# EAGLE design OSSILEDController (EAGLE 6.1)
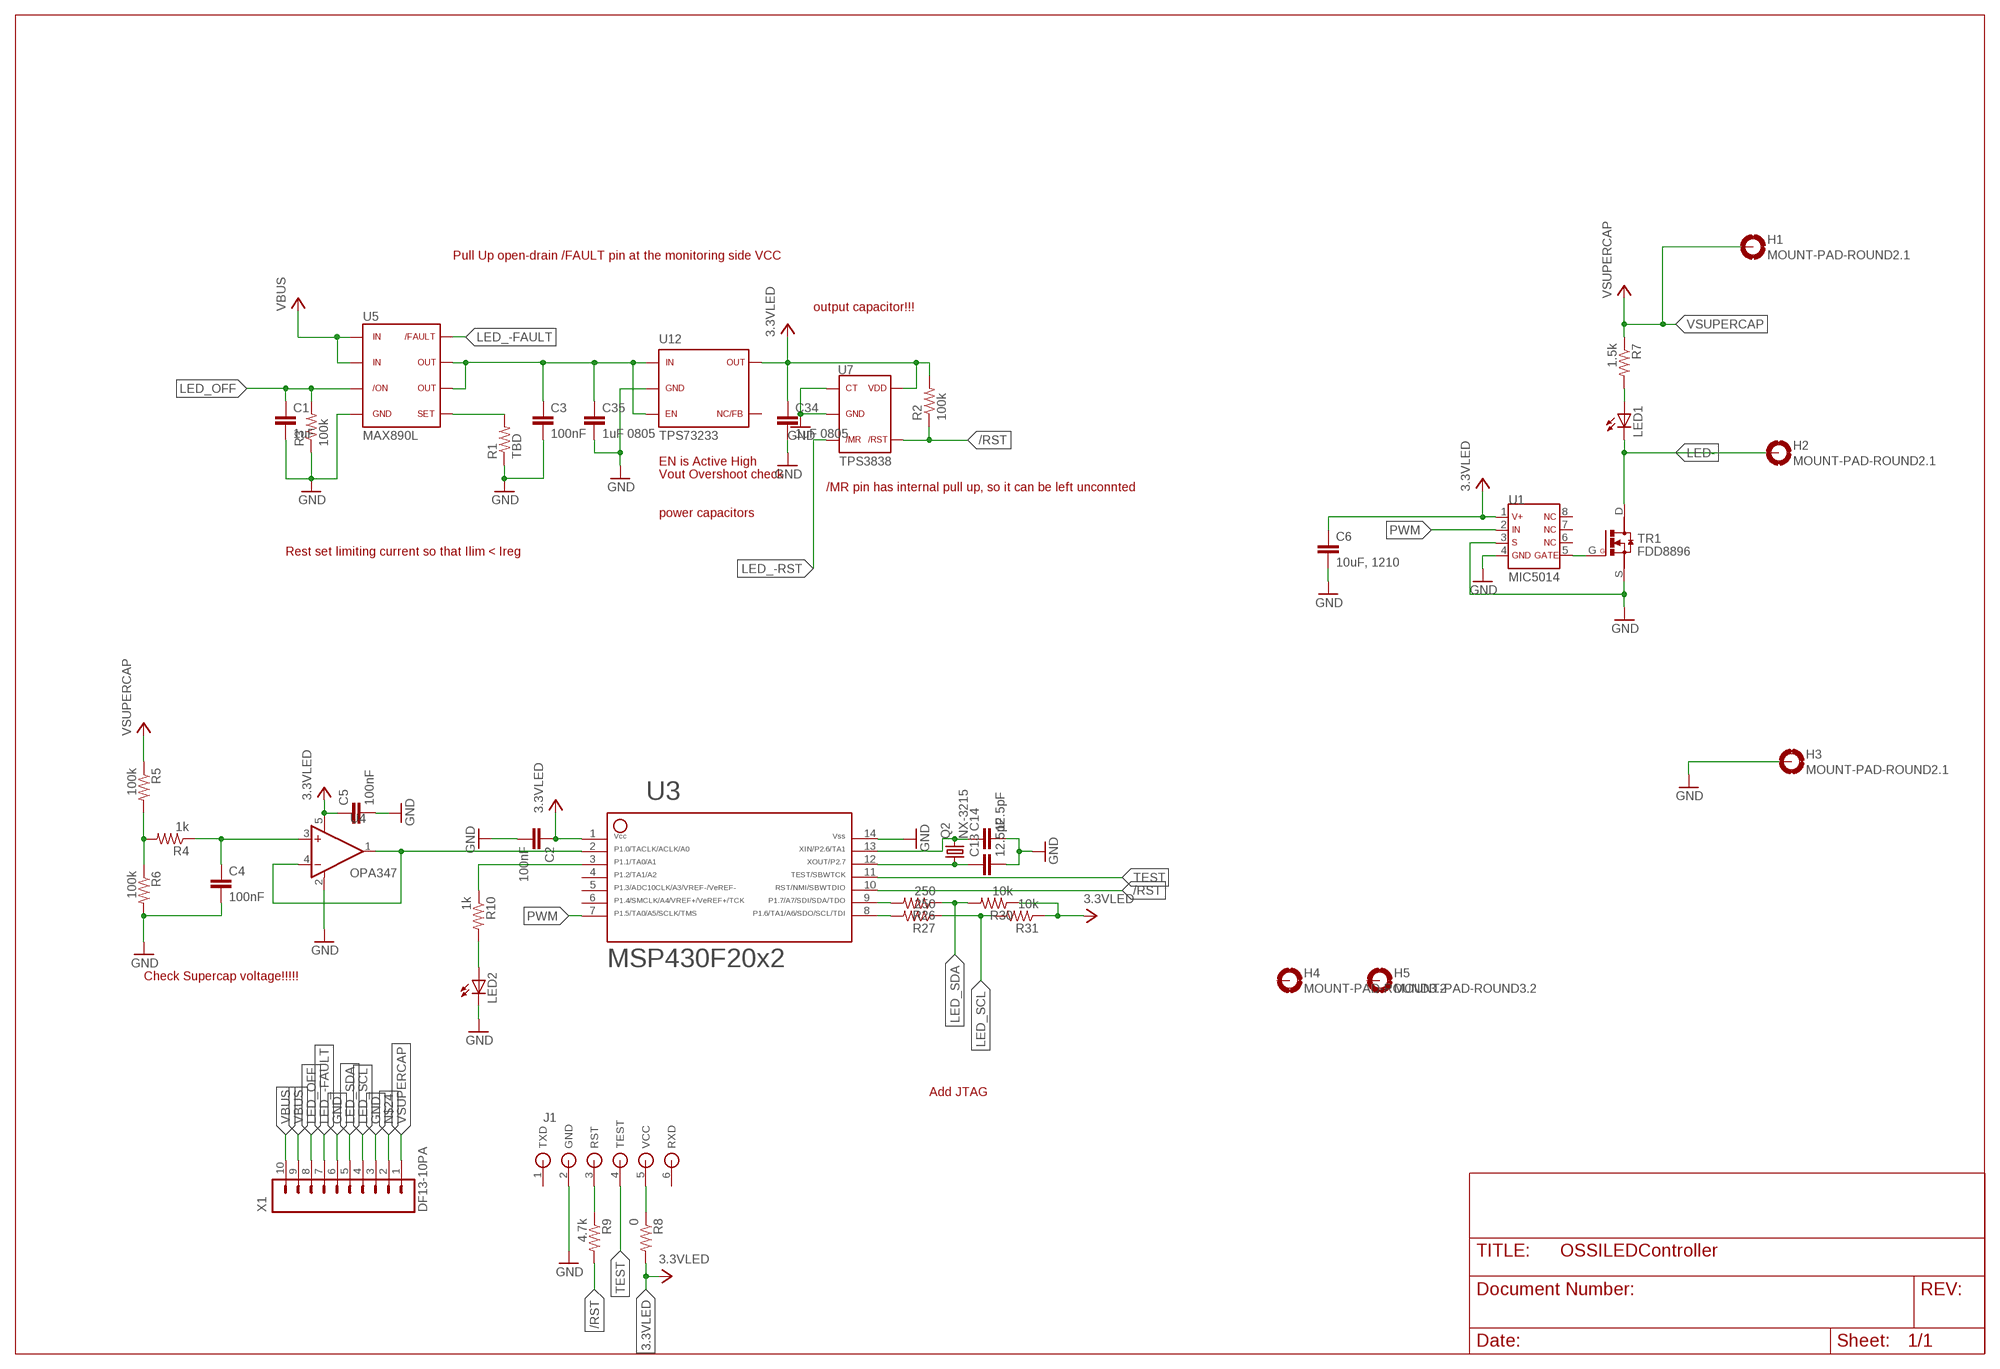
[diagram p0: schematic, sheet 1]

## Parts
C1  1uF  C0603(1608)  [C0603(1608)]
C2  100nF  C0603(1608)  [C0603(1608)]
C3  100nF  C0603(1608)  [C0603(1608)]
C4  100nF  C0603(1608)  [C0603(1608)]
C5  100nF  C0603(1608)  [C0603(1608)]
C6  10uF, 1210  C1210(3225)-GCM32  [C1210-GCM32]
C13  12.5pF  C0603(1608)  [C0603(1608)]
C14  12.5pF  C0603(1608)  [C0603(1608)]
C34  1uF 0805  C0805(2012)  [C0805(2012)]
C35  1uF 0805  C0805(2012)  [C0805(2012)]
H1  MOUNT-PAD-ROUND2.1  [2.1-PAD-ROUND]
H2  MOUNT-PAD-ROUND2.1  [2.1-PAD-ROUND]
H3  MOUNT-PAD-ROUND2.1  [2.1-PAD-ROUND]
H4  MOUNT-PAD-ROUND3.2  [3.2-PAD-ROUND]
H5  MOUNT-PAD-ROUND3.2  [3.2-PAD-ROUND]
J1  JTAG-SBW-6  [SMD-PAD-6]
LED1  LEDCHIPLED_0603  [CHIPLED_0603]
LED2  LEDCHIPLED_0603  [CHIPLED_0603]
Q2  NX-3215  [NX-3215]
R1  TBD  R0603(1608)  [R0603(1608)]
R2  100k  R0603(1608)  [R0603(1608)]
R3  100k  R0603(1608)  [R0603(1608)]
R4  1k  R0603(1608)  [R0603(1608)]
R5  100k  R0603(1608)  [R0603(1608)]
R6  100k  R0603(1608)  [R0603(1608)]
R7  1.5k  R0603(1608)  [R0603(1608)]
R8  0  R0603(1608)  [R0603(1608)]
R9  4.7k  R0603(1608)  [R0603(1608)]
R10  1k  R0603(1608)  [R0603(1608)]
R26  250  R0603(1608)  [R0603(1608)]
R27  250  R0603(1608)  [R0603(1608)]
R30  10k  R0603(1608)  [R0603(1608)]
R31  10k  R0603(1608)  [R0603(1608)]
TR1  FDD8896  [TO252]
U1  MIC5014  [SO8]
U3  MSP430F2012  [PW14]
U4  OPA347  [SOT23-5DBV]
U5  MAX890L  [SO8]
U7  TPS3838  [SOT23-5DBV]
U12  TPS73233  [SOT23-5DBV]
X1  DF13-10PA  [DF13A-10P]

## Nets
3.3VLED: C2.1 C5.1 C6.P$1 C34.1 R2.2 R8.2 R30.1 R31.1 U1.1 U3.1 U4.5(V+) U7.5 U12.5
/RST: R2.1 R9.2 U3.10 U7.4
GND: C1.2 C2.2 C3.2 C4.2 C5.2 C6.P$2 C13.2 C14.2 C34.2 C35.2 H3.B3,2(MOUNT) J1.2(GND) LED2.C R1.1 R3.1 R6.2 TR1.S U1.3 U1.4 U3.14 U4.2(V-) U5.4 U7.1 U7.2 U12.2 X1.3 X1.6
LED-: H2.B3,2(MOUNT) LED1.C TR1.D
LED_-FAULT: U5.8 X1.7
LED_-RST: U7.3
LED_OFF: C1.1 R3.2 U5.3 X1.8
LED_SCL: R27.1 R31.2 X1.4
LED_SDA: R26.1 R30.2 X1.5
N$1: TR1.G U1.5
N$2: J1.3(RST) R9.1
N$3: C4.1 R4.1 U4.3(+IN)
N$4: R26.2 U3.9
N$5: C3.1 C35.1 U5.6 U5.7 U12.1 U12.3
N$6: C13.1 Q2.1 U3.12
N$7: C14.1 Q2.2 U3.13
N$8: R27.2 U3.8
N$10: R1.2 U5.5
N$11: R4.2 R5.2 R6.1
N$12: LED1.A R7.2
N$13: LED2.A R10.2
N$14: U3.2 U4.1(OUT) U4.4(-IN)
N$15: J1.5(VCC) R8.1
N$16: R10.1 U3.3
N$24: X1.2
PWM: U1.2 U3.7
TEST: J1.4(TEST) U3.11
VBUS: U5.1 U5.2 X1.9 X1.10
VSUPERCAP: H1.B3,2(MOUNT) R5.1 R7.1 X1.1
Unconnected: H4.B3,2(MOUNT) H5.B3,2(MOUNT) J1.1(TXD) J1.6(RXD) U1.6 U1.7 U1.8 U3.4 U3.5 U3.6 U12.4

## Notes on the sheet
- Pull Up open-drain /FAULT pin at the monitoring side VCC
- output capacitor!!!
- EN is Active High
- Vout Overshoot check
- /MR pin has internal pull up, so it can be left unconnted
- power capacitors
- Rest set limiting current so that Ilim < Ireg
- Check Supercap voltage!!!!!
- Add JTAG

## Library data of the parts
C1-C6 C13 C14 C34 C35 = OSSI:C
H1-H5 = OSSI:MOUNT-PAD-ROUND
J1 = CC430:JTAG-SBW-6
LED1 LED2 = led:LED: LED OSRAM: - CHIPLED LG R971, LG N971, LY N971, LG Q971, LY Q971, LO R971, LY R971 LH N974, LH R974 LS Q976, LO Q976, LY Q976 LO Q996 - Hyper CHIPLED LW Q18S LB Q993, LB Q99A, LB R99A - SideLED LS A670, LO A670, LY A670, LG A670, LP A670 LB A673, LV A673, LT A673, LW A673 LH A674 LY A675 LS A676, LA A676, LO A676, LY A676, LW A676 LS A679, LY A679, LG A679 - Hyper Micro SIDELED® LS Y876, LA Y876, LO Y876, LY Y876 LT Y87S - SmartLED LW L88C, LW L88S LB L89C, LB L89S, LG L890 LS L89K, LO L89K, LY L89K LS L896, LA L896, LO L896, LY L896 - TOPLED LS T670, LO T670, LY T670, LG T670, LP T670 LSG T670, LSP T670, LSY T670, LOP T670, LYG T670 LG T671, LOG T671, LSG T671 LB T673, LV T673, LT T673, LW T673 LH T674 LS T676, LA T676, LO T676, LY T676, LB T676, LH T676, LSB T676, LW T676 LB T67C, LV T67C, LT T67C, LS T67K, LO T67K, LY T67K, LW E67C LS E67B, LA E67B, LO E67B, LY E67B, LB E67C, LV E67C, LT E67C LW T67C LS T679, LY T679, LG T679 LS T770, LO T770, LY T770, LG T770, LP T770 LB T773, LV T773, LT T773, LW T773 LH T774 LS E675, LA E675, LY E675, LS T675 LS T776, LA T776, LO T776, LY T776, LB T776 LHGB T686 LT T68C, LB T68C - Hyper Mini TOPLED® LB M676 - Mini TOPLED Santana® LG M470 LS M47K, LO M47K, LY M47K Source: http://www.osram.convergy.de LUXEON: - LUMILED® LXK2-PW12-R00, LXK2-PW12-S00, LXK2-PW14-U00, LXK2-PW14-V00 LXK2-PM12-R00, LXK2-PM12-S00, LXK2-PM14-U00 LXK2-PE12-Q00, LXK2-PE12-R00, LXK2-PE12-S00, LXK2-PE14-T00, LXK2-PE14-U00 LXK2-PB12-K00, LXK2-PB12-L00, LXK2-PB12-M00, LXK2-PB14-N00, LXK2-PB14-P00, LXK2-PB14-Q00 LXK2-PR12-L00, LXK2-PR12-M00, LXK2-PR14-Q00, LXK2-PR14-R00 LXK2-PD12-Q00, LXK2-PD12-R00, LXK2-PD12-S00 LXK2-PH12-R00, LXK2-PH12-S00 LXK2-PL12-P00, LXK2-PL12-Q00, LXK2-PL12-R00 Source: www.luxeon.com KINGBRIGHT: KA-3528ASYC Source: www.kingbright.com
Q2 = OSSI:NX-3215: NDK 32.768 kHz SMD Crystal P/N: NX3215SA-32.768K-STD-MUA-9 Nominal frequency (kHz): 32.768 Package Size (L×W×H : mm): 3.2×1.5×0.8 Operating Temperature Range(*1) / Storage Temperature Range (°C): -40 to +85 / -40 to +85 Level of drive: 0.1µW (Max. 0.5µW) Frequency Tolerance (25±3°C): ±20×10-6 Load Capacitance: 9.0pF, 12.5pF Equivalent Series Resistance: 70kΩ Max. Ordering Code: NX3215SA-32.768K-STD-MUA-9 (Load Capacitance9.0pF) /NX3215SA-32.768K-STD-MUA-8 (Load Capacitance12.5pF)
R1-R10 R26 R27 R30 R31 = OSSI:R
TR1 = OSSI:FDD8896: FDD8896 N-Channel PowerTrench ® MOSFET
U1 = OSSI:MIC5014: MIC5014 Low-Cost High- or Low-Side MOSFET Driver
U3 = OSSI:MSP430F2012: ***MSP430F20x2***PW14
U4 = OSSI:OPA347: OPA347 RAIL-TO-RAIL INPUT AND OUTPUT SINGLE SUPPLY: 2.3V to 5.5V LOW IQ: 20µ
U5 = OSSI:MAX890L: MAX 890L 1.2A, Current-Limited, High-Side P-Channel Switch with Thermal Shutdown BY MAXIM
U7 = OSSI:TPS3838: TPS3838 NanoPower Supervisory IC from texas instruments. TPS3838 is open-drain output
U12 = OSSI:TPS732*: TPS732XX LDO 250mA / 40mV drop out EN pin is Active High!!
X1 = OSSI:DF13-10P

## Board
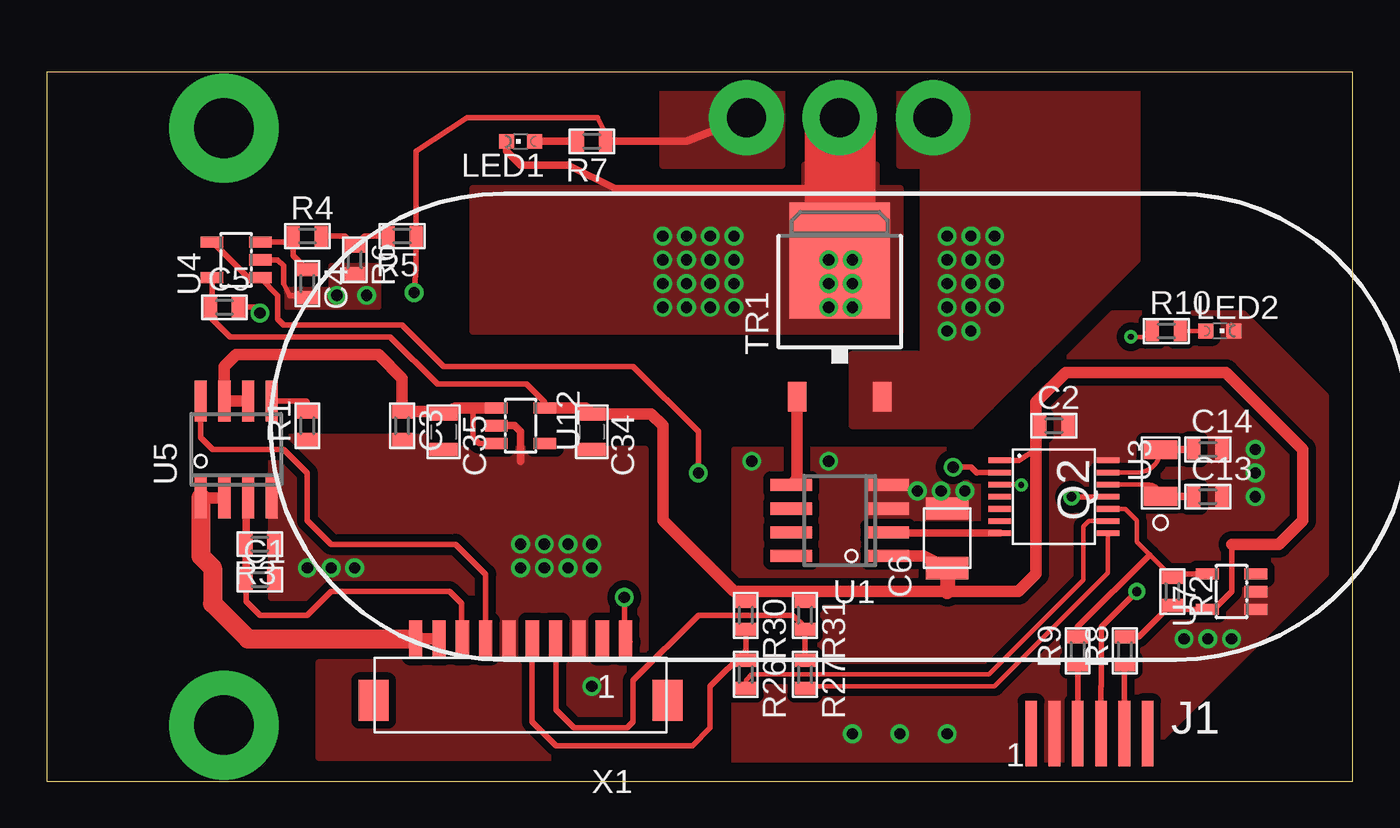
[diagram p1: board, top side]
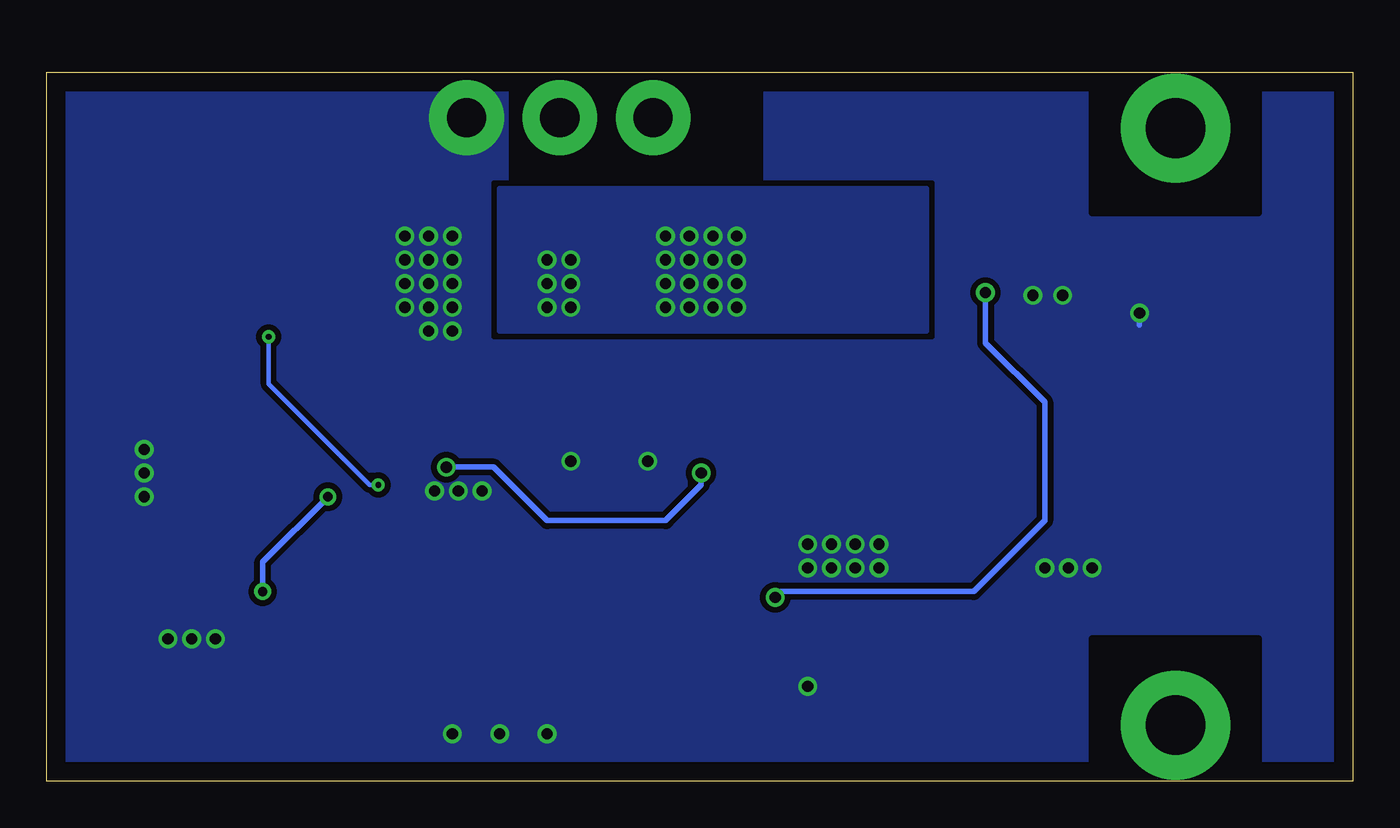
[diagram p2: board, bottom side, seen from below]

Size 70 x 38 mm. Coordinates in mm from the lower left corner, seen from the top.
Outline: 0,0 70,0 70,38 0,38 0,0
Copper layers (1*16): Top 0.035mm / dielectric 1.5mm / Bottom 0.035mm
Design rules: minimum track width 10mil, minimum drill 24mil, track to track 8mil, track to pad 8mil, pad to pad 8mil, via to via 8mil, smd to smd 8mil, copper to edge 40mil, drill to drill 8mil, minimum pad ring 10mil, minimum via ring 8mil, stop-mask expansion 4mil, vias tented up to drill 0mil, thermal gap 10mil

### Footprints (pad centres in the part's own frame; a part is rotated, then mirrored left to right if it is on the bottom)
C0603(1608) = smd 0.7 x 1.1: 1 -0.75,0; 2 0.75,0
C1210-GCM32 = smd 1.2 x 2.3: P$1 -1.6,0; P$2 1.6,0
C0805(2012) = smd 0.7 x 1.5: 1 -0.95,0; 2 0.95,0
2.1-PAD-ROUND = drill 2.1 pad 4: B3,2 0,0
3.2-PAD-ROUND = drill 3.2 pad 5.842: B3,2 0,0
SMD-PAD-6 = smd 0.625 x 3.5: 1 -3.125,0; 2 -1.875,0; 3 -0.625,0; 4 0.625,0; 5 1.875,0; 6 3.125,0
CHIPLED_0603 = smd 0.8 x 0.8: A 0,-0.75; C 0,0.75
NX-3215 = smd 1 x 1.8: 1 -1.25,0; 2 1.25,0
R0603(1608) = smd 0.7 x 1.1: 1 -0.75,0; 2 0.75,0
TO252 = smd 5.4 x 6.2: D 0,2.5 | smd 1 x 1.6: G -2.28,-4.8; S 2.28,-4.8
SO8 = smd 0.65 x 2.2: 1 -1.905,-2.6; 2 -0.635,-2.6; 3 0.635,-2.6; 4 1.905,-2.6; 5 1.905,2.6; 6 0.635,2.6; 7 -0.635,2.6; 8 -1.905,2.6
PW14 = smd 0.3 x 1.2: 1 -1.95,-2.9; 2 -1.3,-2.9; 3 -0.65,-2.9; 4 0,-2.9; 5 0.65,-2.9; 6 1.3,-2.9; 7 1.95,-2.9; 8 1.95,2.9; 9 1.3,2.9; 10 0.65,2.9; 11 0,2.9; 12 -0.65,2.9; 13 -1.3,2.9; 14 -1.95,2.9
SOT23-5DBV = smd 0.6 x 1.22: 1 -0.95,-1.3; 2 0,-1.3; 3 0.95,-1.3; 4 0.95,1.3; 5 -0.95,1.3
DF13A-10P = smd 0.7 x 2: 1 -5.625,0; 2 -4.375,0; 3 -3.125,0; 4 -1.875,0; 5 -0.625,0; 6 0.625,0; 7 1.875,0; 8 3.125,0; 9 4.375,0; 10 5.625,0 | smd 1.6 x 2.2: P$1 -7.875,3.3; P$2 7.875,3.3

### Placement (x,y rotation side)
C1  11.43,10.79 0 top
C2  53.98,19.05 0 top
C3  19.05,19.05 270 top
C4  13.97,26.67 270 top
C5  9.53,25.4 0 top
C6  48.26,13.02 90 top
C13  62.23,15.24 0 top
C14  62.23,17.78 0 top
C34  29.21,18.73 270 top
C35  21.27,18.73 270 top
H1  37.5,35.56 0 top
H2  42.5,35.56 0 top
H3  47.5,35.56 0 top
H4  9.5,35 0 top
H5  9.5,3 0 top
J1  55.88,2.54 0 top
LED1  25.4,34.29 90 top
LED2  62.87,24.13 270 top
Q2  59.69,16.51 90 top
R1  13.97,19.05 90 top
R2  60.33,10.16 270 top
R3  11.43,12.7 180 top
R4  13.97,29.21 0 top
R5  19.05,29.21 180 top
R6  16.51,27.94 270 top
R7  29.21,34.29 180 top
R8  57.78,6.99 90 top
R9  55.24,6.99 90 top
R10  60.01,24.13 0 top
R26  37.47,5.71 270 top
R27  40.64,5.71 270 top
R30  37.47,8.89 270 top
R31  40.64,8.89 270 top
TR1  42.5,25.4 0 top
U1  42.5,13.97 90 top
U3  53.98,15.24 270 top
U4  10.16,27.94 90 top
U5  10.16,17.78 0 top
U7  63.5,10.16 90 top
U12  25.4,19.05 270 top
X1  25.4,7.62 180 top

### Tracks (layer width: path | path; a pad name or v marks a point on that pad's centre or on a via)
3.3VLED
  Top 0.305: U3.1 52.12,17.19 53.02,17.78 | 63.5,12.7 63.5,10.16 62.55,9.21 U7.5 60.52,9.21 R2.2 60.21,9.41 58.53,7.74 R8.2 | R30.1 37.47,10.16 | R31.1 40.64,10.16 | U4.5 8.86,25.95 C5.1 8.78,24.88 9.84,23.81 18.41,23.81 20.95,21.27 25.72,21.27 26.67,20.32 26.67,20 U12.5
  Top 0.61: U12.5 28.89,20 C34.1 32.39,19.68 33.02,19.05 33.02,13.97 36.83,10.16 37.47,10.16 40.64,10.16 48.26,10.16 52.07,10.16 53.02,11.11 53.02,17.78 53.02,19.05 | 53.02,19.05 53.02,20.32 54.61,21.91 63.18,21.91 67.31,17.78 67.31,13.97 66.04,12.7 63.5,12.7 | C2.1 53.02,19.05 | U1.1 46.98,12.06 C6.P$1
  Top 0.813: C6.P$1 48.26,10.16
/RST
  Top 0.254: U3.10 57.8,14.59 58.42,13.97 58.42,12.81 59.11,12.12 R2.1
  Top 0.305: U7.4 60.52,11.11 R2.1 | R9.2 55.24,8.26 59.11,12.12
GND  (via drill 0.6)
  Top 0.305: U4.2 12.38,27.94 12.7,27.62 12.7,26.67 13.02,26.04 13.86,26.04 C4.2 | C5.2 11.11,25.4 v11.43,25.08
  Top 0.406: U12.2 25.08,19.05 25.4,18.73 25.4,17.14
  Bottom 0.305: v11.43,25.08 11.43,24.45
  other vias: 25.4,11.43 27.94,11.43 29.21,11.43 26.67,11.43 25.4,12.7 26.67,12.7 27.94,12.7 29.21,12.7 13.97,11.43 15.24,11.43 16.51,11.43 63.5,7.62 62.23,7.62 60.96,7.62 48.26,2.54 45.72,2.54 43.18,2.54 64.77,17.78 64.77,15.24 64.77,16.51 46.67,15.56 47.94,15.56 49.21,15.56 29.21,5.08 37.78,17.14 41.91,17.14 15.56,26.04 17.14,26.04 48.26,29.21 48.26,27.94 48.26,26.67 48.26,25.4 48.26,24.13 49.53,24.13 49.53,25.4 49.53,27.94 49.53,26.67 49.53,29.21 50.8,29.21 50.8,27.94 50.8,26.67 50.8,25.4
  pour Top (no thermals): 43.18,22.86 43.18,19.05 49.53,19.05 58.42,27.94 58.42,37.47 45.72,37.47 45.72,33.02 46.99,33.02 46.99,22.86
  pour Bottom (isolate 0.305, rank 2, no thermals): 0,38.1 69.85,38.1 69.85,0 0,0
  pour Top (isolate 0.406, no thermals): 30.48,17.78 20.32,17.78 20.32,18.41 12.06,18.41 12.06,9.84 24.13,9.84 24.13,6.35 17.78,6.35 14.61,6.35 14.61,1.27 32.07,1.27 32.07,17.78
  pour Top (isolate 0.406, no thermals): 38.1,17.78 52.07,17.78 52.07,20 57.15,25.08 64.14,25.08 68.58,20.64 68.58,11.11 59.69,2.22 59.69,0.95 36.83,0.95 36.83,17.78
  pour Top (no thermals): 17.78,27.62 15.24,27.62 15.24,26.35 12.86,26.35 12.86,25.4 17.78,25.4
LED-  (via drill 0.6)
  Top 0.406: LED1.C 24.65,33.77 25.4,33.02 27.94,33.02 30.48,31.75 42.5,31.75
  Top 3.81: H2.B3,2 42.5,31.75 TR1.D
  other vias: 36.83,29.21 36.83,27.94 36.83,26.67 36.83,25.4 35.56,25.4 35.56,26.67 35.56,27.94 35.56,29.21 34.29,29.21 34.29,27.94 34.29,26.67 34.29,25.4 33.02,25.4 33.02,26.67 33.02,27.94 33.02,29.21 41.91,27.94 43.18,27.94 43.18,26.67 41.91,26.67 41.91,25.4 43.18,25.4
  pour Top (isolate 0.61, no thermals): 45.72,24.13 45.72,31.75 44.45,31.75 44.45,33.02 40.64,33.02 40.64,31.75 30.48,31.75 22.86,31.75 22.86,24.13
  pour Bottom (isolate 0.813): 22.86,31.75 22.86,24.13 45.72,24.13 45.72,31.75
LED_-FAULT
  Top 0.305: U5.8 8.26,18.41 8.89,17.78 12.7,17.78 13.97,16.51 13.97,13.97 15.24,12.7 21.91,12.7 23.52,11.08 X1.7
LED_OFF
  Top 0.305: C1.1 10.68,9.64 11.43,8.89 13.97,8.89 15.24,10.16 21.59,10.16 22.23,9.53 22.23,7.67 X1.8
  Top 0.406: U5.3 10.68,15.06 R3.2 C1.1
LED_SCL
  Top 0.305: R27.1 R31.2 40.64,8.26 40.01,8.89 34.92,8.89 31.43,5.4 31.43,3.17 31.11,2.86 28.26,2.86 27.3,3.81 27.3,7.59 X1.4
LED_SDA
  Top 0.305: R26.1 R30.2 37.47,6.99 35.56,5.08 35.56,2.86 34.61,1.91 27.3,1.91 26.02,3.19 X1.5
N$1
  Top 0.61: TR1.G 40.22,16.2 U1.5
N$2
  Top 0.305: J1.3 55.26,6.22 R9.1
N$3
  Top 0.305: U4.3 13.02,28.89 13.34,29.21 R4.1 13.22,28.17 C4.1
N$4
  Top 0.254: U3.9 55.85,13.94 55.56,13.65 55.56,10.79 50.48,5.71 37.78,5.71 37.47,5.4 R26.2
N$5
  Top 0.305: U12.3 23.18,18.1 22.86,18.41 22.86,20 21.85,20 21.78,19.94
  Top 0.61: U12.1 21.91,20 21.78,19.94 C35.1 21.47,19.8 C3.1 19.05,21.59 17.78,22.86 10.16,22.86 9.53,22.23 U5.7 U5.6
N$6
  Top 0.254: U3.12 59.06,15.89 arc-90 Q2.1
  Top 0.406: Q2.1 61.46,15.26 C13.1
N$7
  Top 0.254: U3.13 58.47,16.54 arc90 Q2.2
  Top 0.406: C14.1 59.71,17.78 Q2.2
N$8
  Top 0.254: U3.8 56.88,11.15 50.8,5.08 40.64,5.08 R27.2
N$9
  cutout Bottom: 5.08,38.1 5.08,30.48 13.97,30.48 13.97,38.1
N$10
  Top 0.305: U5.5 13.91,20.38 13.97,20.32 R1.2
N$11
  Top 0.305: R4.2 15.99,29.21 R6.1 17.03,29.21 R5.2
N$12
  Top 0.406: R7.2 LED1.A
N$13
  Top 0.254: R10.2 LED2.A 62.23,24.13
N$14  (via drill 0.6)
  Top 0.305: U4.4 8.89,28.89 10.79,26.99 U4.1 11.46,26.96 12.38,26.04 12.38,24.77 12.7,24.45 19.05,24.45 21.27,22.23 31.43,22.23 34.92,18.73 v34.92,16.51 | v48.58,16.83 49.53,16.83 49.85,16.51 49.88,16.54 U3.2
  Bottom 0.305: v34.92,16.51 34.92,15.88 36.83,13.97 43.18,13.97 46.04,16.83 v48.58,16.83
N$15
  Top 0.305: J1.5 57.76,6.21 R8.1
N$16  (via drill 0.3)
  Top 0.254: U3.3 52.05,15.89 v52.23,15.88 | v58.1,23.81 58.74,23.81 59.05,24.13 R10.1
  Bottom 0.254: v52.23,15.88 52.7,15.88 58.1,21.27 v58.1,23.81
N$17
  cutout Bottom: 5.08,0 5.08,7.62 13.97,7.62 13.97,0
N$18
  cutout Bottom (no thermals): 45.09,38.1 45.09,32.54 31.75,32.54 31.75,38.1
PWM
  Top 0.406: U3.7 45.15,13.29 U1.2
TEST  (via drill 0.5)
  Top 0.305: J1.4 56.51,5.07 56.52,5.08 56.52,8.26 v58.42,10.16 | v54.93,15.24 U3.11
  Bottom 0.305: v58.42,10.16 58.42,11.75 v54.93,15.24
VBUS
  Top 0.61: X1.9 X1.10 | U5.2 U5.1
  Top 1.016: U5.1 8.26,12.06 8.89,11.43 8.89,9.53 10.79,7.62 X1.10
VSUPERCAP  (via drill 0.6)
  Top 0.305: R7.1 29.84,34.41 29.84,34.92 29.53,35.56 22.54,35.56 19.8,33.77 R5.1 19.8,27.51 v19.68,26.19 | v30.96,9.84 30.96,7.78 31.27,7.46 31.18,7.46 X1.1
  Top 0.406: R7.1 34.29,34.29 H1.B3,2
  Bottom 0.305: v19.68,26.19 19.68,23.5 16.51,20.32 16.51,13.97 20.32,10.16 30.64,10.16 v30.96,9.84
  pour Top (no thermals): 39.37,38.1 39.37,33.02 34.29,33.02 33.02,33.02 33.02,38.1